# Altium schematic sheet conn_usbc.SchDoc
size A
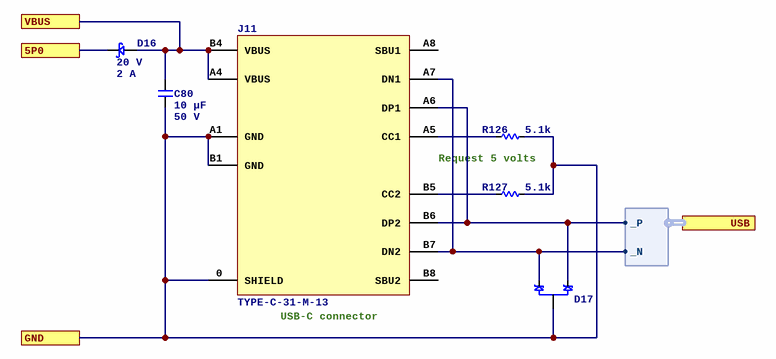
[diagram p0: conn_usbc.SchDoc]

## Parts
C80  Capacitance: 10 µF  Voltage Rating: 50 V  [C1206]  (hidden comment: CL31B106KBHNNNE)
D16  Vr: 20 V  Current: 2 A  [ESMP]  (hidden comment: MSS2P2-M3/89A)
D17  PESD2USB3UX  [3SOT23]  (value not drawn)
J11  TYPE-C-31-M-13  [CONN_USBC_TYPE-C-31-M-13]
R126  value 5.1k  [R0402]  (hidden comment: 0402WGF5101TCE)
R127  value 5.1k  [R0402]  (hidden comment: 0402WGF5101TCE)

## Ports
5P0, GND, USB (harness DIFF), VBUS

## Harnesses
DIFF: _P, _N

## Nets
5P0: D16.2 ; port 5P0
GND: C80.2 D17.3 J11.0(SHIELD) J11.A1(GND) J11.B1(GND) R126.1 R127.1 ; port GND
VBUS: C80.1 D16.1 J11.A4(VBUS) J11.B4(VBUS) ; port VBUS
NetD17_1: D17.1 J11.A7(DN1) J11.B7(DN2) ; port USB._N
NetD17_2: D17.2 J11.A6(DP1) J11.B6(DP2) ; port USB._P
NetJ11_A5: J11.A5(CC1) R126.2
NetJ11_B5: J11.B5(CC2) R127.2

Not connected (* = marked no-connect by the designer): J11 A8(SBU1) B8(SBU2)

## Notes on the sheet
- Request 5 volts
- (near J11) USB-C connector

## Library data of the parts
C80 = CL31B106KBHNNNE: Manufacturer: Samsung Electro-Mechanics; Dielectric: X7R; ComponentLink1URL: https://wmsc.lcsc.com/wmsc/upload/file/pdf/v2/lcsc/1810221111_Samsung-Electro-Mechanics-CL31B106KBHNNNE_C89632.pdf; ComponentLink1Description: Datasheet; Manufacturer Part Number: CL31B106KBHNNNE; Package: 1206; Supplier 2: LCSC; Supplier Part Number 2: C89632
D16 = MSS2P2-M3/89A: DIODE SCHOTTKY 20V 2A MICROSMP; Manufacturer: Vishay Semiconductor Diodes Division; Supplier 1: DigiKey; Manufacturer Part Number: MSS2P2-M3/89A; ComponentLink1URL: http://www.vishay.com/docs/89054/mss2p3.pdf; ComponentLink1Description: Datasheet; Supplier Part Number 1: MSS2P2-M3/89AGICT-ND; Supplier 2: LCSC; Supplier Part Number 2: C2978531; Diode Type: Schottky; Supplier 3: Mouser; Supplier Part Number 3: 625-MSS2P2-M3
D17 = PESD2USB3UX: DIODE ESD USB SOT-23; Manufacturer: Nexperia USA Inc.; Polarity: Unidirectional; Capacitance (pF): 0.7; Standoff (V): 3.3; Min Breakdown Voltage: 4.2 V; Supplier 1: DigiKey; Supplier Part Number 1: 1727-PESD2USB3UX-CT-ND; Manufacturer Part Number: PESD2USB3UX; Supplier 2: LCSC; Supplier Part Number 2: C3708426; ComponentLink1Description: Datasheet; ComponentLink1URL: https://assets.nexperia.com/documents/data-sheet/PESD2USB3UX-T.pdf; Supplier 3: Mouser; Supplier Part Number 3: 771-PESD2USB3UX-TR
J11 = TYPE-C-31-M-13: USB 2.0 12P USB-C connector; Manufacturer: HRO Electronics; Manufacturer Part Number: TYPE-C-31-M-13; Supplier 2: LCSC; Supplier Part Number 2: C223906; ComponentLink1Description: Datasheet; ComponentLink1URL: https://www.lcsc.com/datasheet/C223906.pdf
R126 R127 = 0402WGF5101TCE: Manufacturer: UNI-ROYAL(Uniroyal Elec); Tolerance: 1%; Temperature Coefficient: ±100ppm/?; Power Rating (mW): 62.5; ComponentLink1Description: Datasheet; ComponentLink1URL: https://wmsc.lcsc.com/wmsc/upload/file/pdf/v2/lcsc/2206010045_UNI-ROYAL-Uniroyal-Elec-0402WGF5101TCE_C25905.pdf; Manufacturer Part Number: 0402WGF5101TCE; Package: 0402; Supplier 2: LCSC; Supplier Part Number 2: C25905